# EasyEDA Pro project LOONGSON_DOCKER.epro, board PCB1
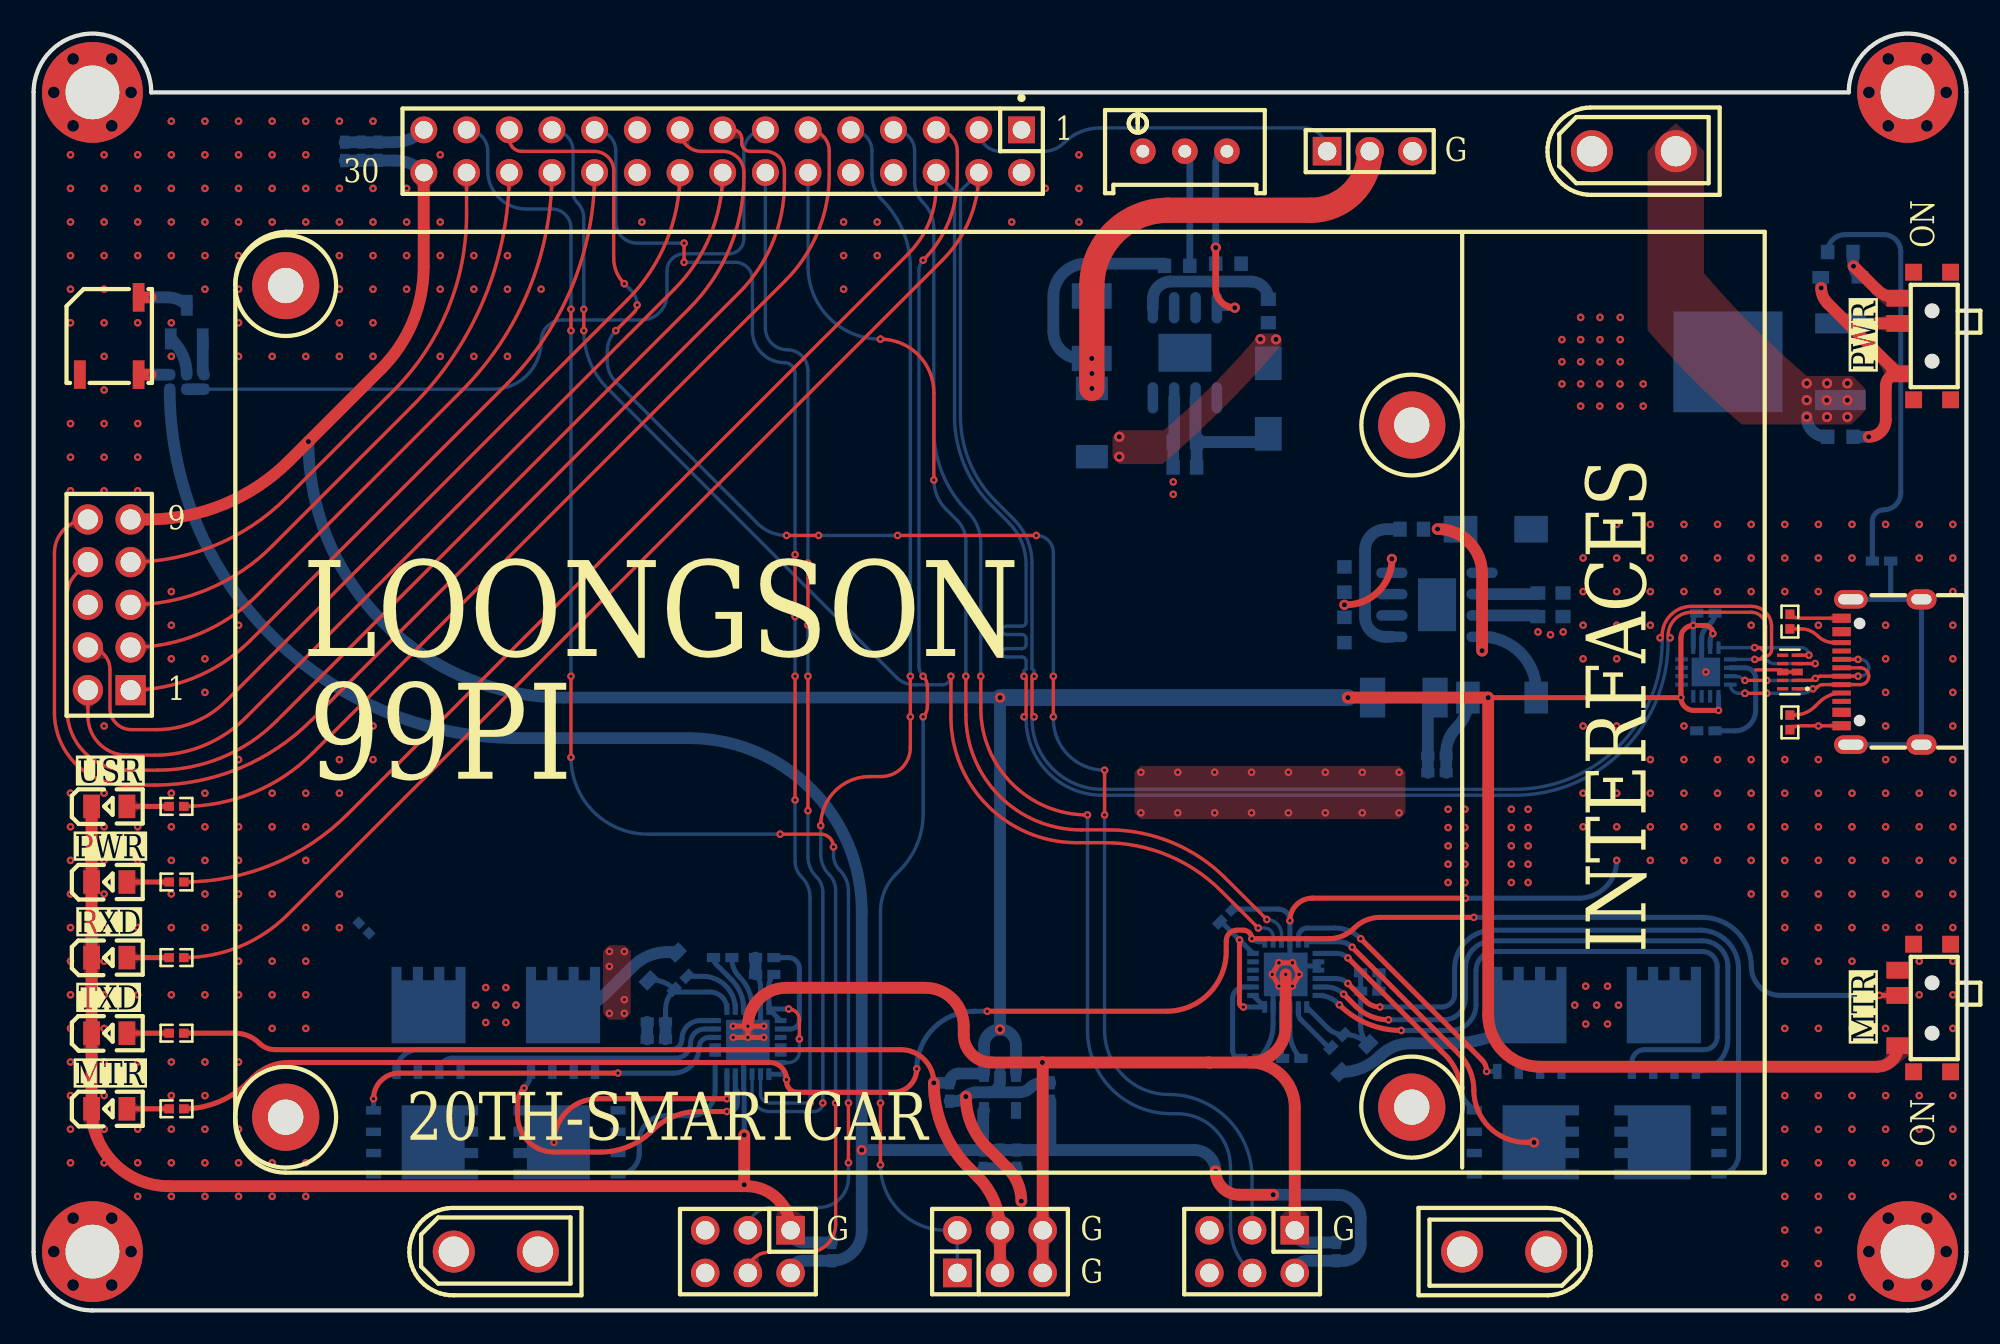
[diagram p3: board, top side]
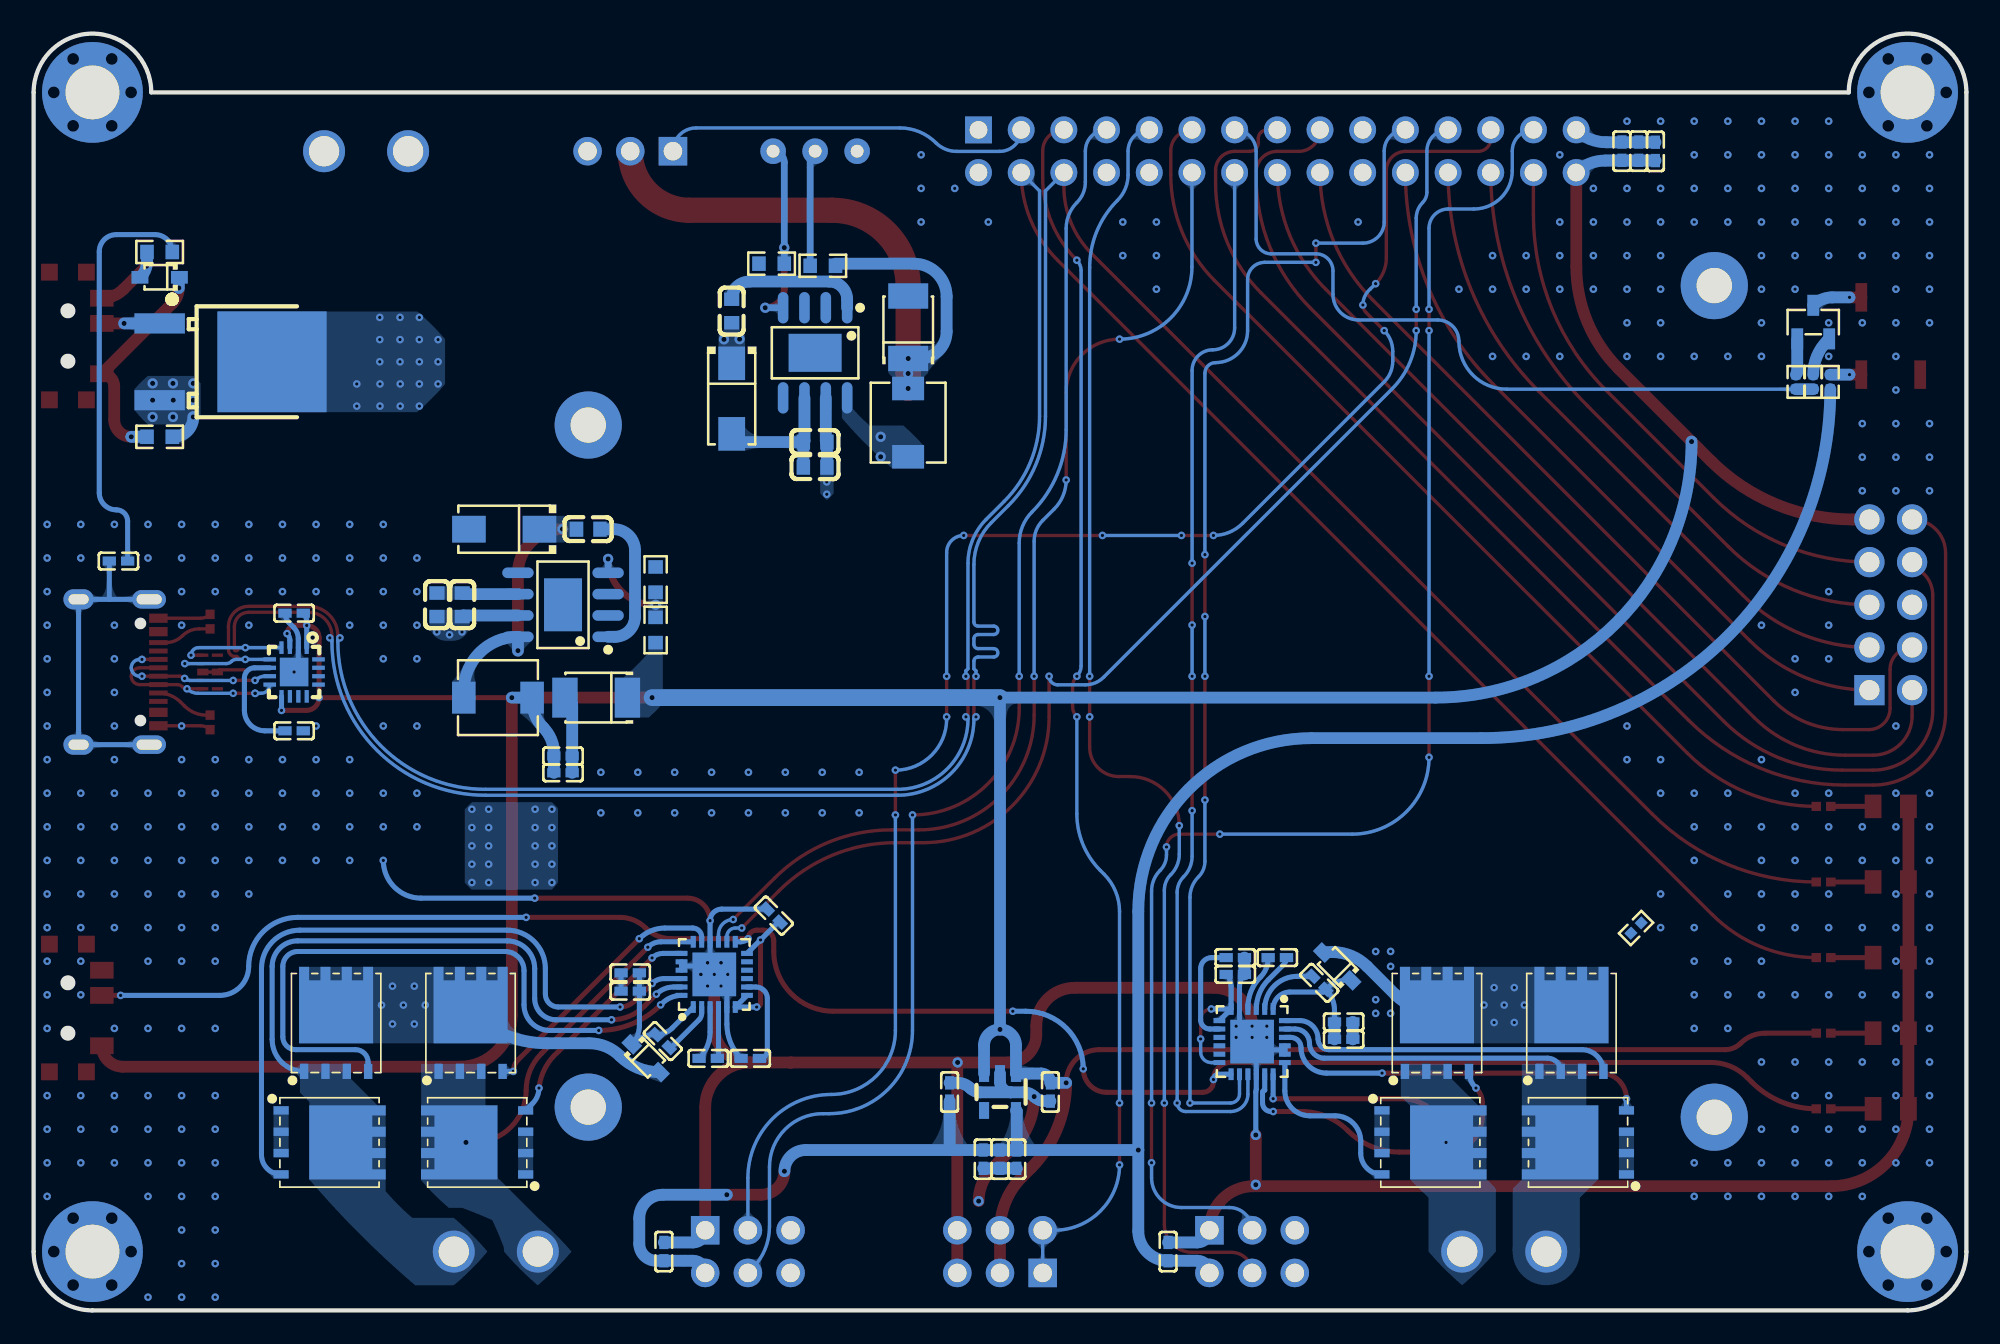
[diagram p4: board, bottom side, seen from below]

Outline 115 x 76 mm; copper layers: Top Layer, Bottom Layer. Coordinates in mm from the lower left corner of the outline.
Outline path: 0,72.5 arc(3.5,76) 7,72.5 108,72.5 arc(111.5,76) 115,72.5 115,3.5 arc(113.97,1.03) 111.5,0 3.5,0 arc(1.03,1.03) 0,3.5 0,72.5
Stack: Top Layer 0.035mm / Dielectric1 1.51mm FR4 er 4.5 / Bottom Layer 0.035mm

## Design rules (mm)
net D+: DP1
net D-: DP1
net 99PI_TXD_0: DP2
net 99PI_RXD_0: DP2
template: 自定义配置
spacing copperThickness1oz (default): track to track 0.102, other pairs 0.152 to 0.3
spacing copperThickness2oz: track to track 0.203, other pairs 0.152 to 0.3
track width copperThickness1oz (default): min 0.13, default 0.13, max 3
track width copperThickness2oz: min 0.203, default 0.254, max 2.54
differential pair differentialPair (default): width min 0.127, default 0.254, max 2.54; gap min 0.152, default 0.152
via viaSize (default): diameter min 0.45, default 0.61, max 10; hole min 0.2, default 0.305, max 6.3

## Placement (name value [footprint] x y rotation side)
BUZZER2  4kHz  [BUZ-SMD_L5.0-W5.5-P4.60]  4.5 58 90 top
C1  100nF  [C0402]  47.5 3.5 270 bottom
C2  100nF  [C0402]  58.5 9 90 bottom
C3  100nF  [C0402]  56.5 9 90 bottom
C4  100nF  [C0402]  57.5 9 90 bottom
C5  4.7uF  [C0402]  77.5 3.5 270 bottom
C56  10uF  [C0402]  54.5 13 90 bottom
C57  10uF  [C0402]  60.5 13 270 bottom
C65  100nF  [C0402]  109.95 44.6 0 bottom
C70  10uF  [C0603]  89.5 42 270 bottom
C78  100nF  [C0603]  82 46.5 180 bottom
C79  220uF  [CASE-B_3528]  81.53 36.47 0 bottom
C80  10uF  [C0603]  91 42 270 bottom
C81  10uF  [C0603]  68.5 50.19 180 bottom
C82  100nF  [C0603]  73.46 59.49 90 bottom
C83  220uF  [CASE-B_3528]  62.96 58.52 90 bottom
C84  10uF  [C0603]  68.5 51.69 180 bottom
C91  10uF  [C0402]  37.05 17.17 180 bottom
C92  100nF  [C0402]  37.05 16.13 180 bottom
C93  10uF  [C0402]  79.5 20.09 0 bottom
C94  100nF  [C0402]  79.5 19 0 bottom
C95  1uF  [C0402]  77.57 16.03 225 bottom
C96  1uF  [C0402]  38.5 19.5 45 bottom
C97  100nF  [C0402]  41 21 180 bottom
C98  100nF  [C0402]  74.86 15 0 bottom
C99  1uF  [C0402]  70.96 23.5 225 bottom
C100  1uF  [C0402]  72.36 15 180 bottom
C101  1uF  [C0402]  43.5 21 0 bottom
C102  1uF  [C0402]  43.5 20 0 bottom
C103  100nF  [C0402]  18.5 68.99 270 bottom
C104  100nF  [C0402]  19.5 69 270 bottom
C105  100nF  [C0402]  20.5 69 270 bottom
C106  100nF  [C0402]  83.5 33 0 bottom
C107  4.7uF  [C0402]  83.5 32 0 bottom
C108  100nF  [C0402]  99.5 41.5 180 bottom
C109  100nF  [C0402]  99.5 34.5 180 bottom
CN5  XT30UPB-M  [CONN-TH_XT30UPB-M]  95.22 69 0 top
CN6  XT30UPB-M  [CONN-TH_XT30UPB-M]  27.5 3.5 0 top
CN7  XT30UPB-M  [CONN-TH_XT30UPB-M]  87.5 3.5 180 top
D1  SS34  [SMA_L4.3-W2.5-LS5.0-RD]  87 46.5 0 bottom
D3  SS34  [SMA_L4.3-W2.5-LS5.0-RD]  73.46 54.28 270 bottom
D4  1N5819WS  [SOD-323_L1.8-W1.3-LS2.5-RD]  78.58 15.01 225 bottom
D5  1N5819WS  [SOD-323_L1.8-W1.3-LS2.5-RD]  37.43 20.47 45 bottom
D6  1N5819WS  [SOD-323_L1.8-W1.3-LS2.5-RD]  107.5 61.5 0 bottom
H1  PZ254V-11-03P  [HDR-TH_3P-P2.54-V-M]  79.5 69 0 top
H4  PZ254V-12-6P  [HDR-TH_6P-P2.54-V-M-R2-C3-S2.54]  42.5 3.5 180 top
H5  PZ254V-12-6P  [HDR-TH_6P-P2.54-V-M-R2-C3-S2.54]  72.5 3.5 180 top
H6  X6521WV-2x15H-C60D30  [HDR-TH_30P-P2.54-V-M-R2-C15-S2.54-BL]  41 69 180 top
H9  PZ2.54-2*5  [HDR-TH_10P-P2.54-V-M-R2-C5-S2.54-1]  4.5 42 90 top
H10  PZ254V-12-6P  [HDR-TH_6P-P2.54-V-M-R2-C3-S2.54]  57.5 3.5 0 top
L5  15uH  [IND-SMD_L4.6-W4.2_SMMS0420]  87.37 36.47 0 bottom
L6  15uH  [IND-SMD_L4.6-W4.2_SMMS0420]  62.97 52.84 270 bottom
LED5  NCD0805R1  [LED0805-R-RD]  4.5 21 0 top
LED6  NCD0805R1  [LED0805-R-RD]  4.5 25.5 0 top
LED7  NCD0805R1  [LED0805-R-RD]  4.5 16.5 0 top
LED8  NCD0805R1  [LED0805-R-RD]  4.5 30 0 top
LED9  NCD0805R1  [LED0805-R-RD]  4.5 12 0 top
NOREF  -  [Pad_e26]  111.5 72.5 0 top
NOREF#2  -  [Pad_e137]  82 12.1 0 top
NOREF#3  -  [Pad_e44]  3.5 72.5 0 top
NOREF#4  -  [Pad_e138]  82 52.7 0 top
NOREF#5  -  [Pad_e133]  15 61 0 top
NOREF#6  -  [Pad_e48]  3.5 3.5 0 top
NOREF#7  -  [Pad_e43]  111.5 3.5 0 top
NOREF#8  -  [Pad_e136]  15 11.5 0 top
Q1  SS8050  [SOT-23-3_L2.9-W1.3-P1.90-LS2.4-BR]  9.11 58.83 270 bottom
Q2  AOD403  [TO-252-3_L6.6-W6.1-P4.58-LS10.1-BR-2]  104.16 56.47 0 bottom
R77  5.1kΩ  [R0402]  104.5 35 270 top
R78  5.1kΩ  [R0402]  104.5 41 90 top
R84  4.7kΩ  [R0603]  107.5 52 0 bottom
R85  1kΩ  [R0603]  107.5 63 0 bottom
R88  3.3kΩ  [R0603]  71.09 62.31 180 bottom
R89  15kΩ  [R0603]  68.04 62.18 180 bottom
R96  10Ω  [R0402]  8.1 55.27 90 bottom
R97  4.7kΩ  [R0402]  10.14 55.27 90 bottom
R98  10kΩ  [R0402]  9.11 55.27 90 bottom
R99  10kΩ  [RES-ADJ-TH_3P-L10.0-W10.0-P2.50-L]  68.5 69 0 top
R100  330Ω  [R0402]  8.5 12 180 top
R101  330Ω  [R0402]  8.5 21 180 top
R102  330Ω  [R0402]  8.5 25.5 180 top
R103  330Ω  [R0402]  8.5 30 180 top
R104  330Ω  [R0402]  8.5 16.5 180 top
R105  3.3kΩ  [R0603]  77.99 43.5 270 bottom
R106  10kΩ  [R0603]  77.99 40.5 270 bottom
R112  0Ω  [R0402]  19.65 22.76 135 bottom
SW1  SK-3296S-01-L1  [SW-SMD_3P-P1.50_L2.7-W6.6]  112.5 58 90 top
SW7  SK-3296S-01-L1  [SW-SMD_3P-P1.50_L2.7-W6.6]  112.5 18 90 top
U8  TPS5430DDA  [ESOP-8_L4.9-W3.9-P1.27-LS6.0-BL-EP-2]  83.5 42 90 bottom
U9  DRV8701ERGET  [VQFN-24_L4.0-W4.0-P0.50-BL-EP2.5]  74.5 20 180 bottom
U10  TPH1R403NL  [TDSON-8_L5.9-W5.2-P1.27-BL]  89 16 180 bottom
U11  TPH1R403NL  [TDSON-8_L5.9-W5.2-P1.27-BL]  87.5 10 90 bottom
U12  TPH1R403NL  [TDSON-8_L5.9-W5.2-P1.27-BL]  97 16 180 bottom
U13  TPH1R403NL  [TDSON-8_L5.9-W5.2-P1.27-BL]  98.5 10 270 bottom
U14  HT7833  [SOT-23-5_L2.9-W1.6-P0.95-LS2.8-BL]  57.5 13 0 bottom
U20  CH343P  [TQFN-16_L3.0-W3.0-P0.50-BL-EP1.7]  99.5 38 0 bottom
U32  TPS5430DDA  [ESOP-8_L4.9-W3.9-P1.27-LS6.0-BL-EP-2]  68.5 57 0 bottom
U33  TPH1R403NL  [TDSON-8_L5.9-W5.2-P1.27-BL]  31.5 16 180 bottom
U34  TPH1R403NL  [TDSON-8_L5.9-W5.2-P1.27-BL]  33 10 270 bottom
U35  TPH1R403NL  [TDSON-8_L5.9-W5.2-P1.27-BL]  23.5 16 180 bottom
U36  TPH1R403NL  [TDSON-8_L5.9-W5.2-P1.27-BL]  22 10 90 bottom
U37  DRV8701ERGET  [VQFN-24_L4.0-W4.0-P0.50-BL-EP2.5]  42.5 16 0 bottom
U38  RCLAMP0524P-ES  [DFN2510-10_L2.5-W1.0-P0.50-BL]  104.5 38 90 top
USB1  TYPE-C 16PIN 2MD(073)  [USB-C-SMD_TYPE-C-6PIN-2MD-073]  109.95 38 90 top

## Footprints (pads in the part's own frame, mm; a bottom-side part is the same pattern mirrored in y, then rotated)
BUZ-SMD_L5.0-W5.5-P4.60
  rect 1.7x0.7 smd: 1(-2.3,-1.75) 2(2.3,-1.75) 3(-2.3,1.75)
C0402
  rect 0.79x0.54 smd: 1(-0.545,0) 2(0.545,0)
C0603
  rect 0.8x0.9 smd: 1(-0.7,0) 2(0.7,0)
CASE-B_3528
  rect 1.506x2.376 smd: 1(-1.861,0) 2(1.861,0)
CONN-TH_XT30UPB-M
  round 2.5 hole 1.8: 1(-2.5,0) 2(2.5,0)
DFN2510-10_L2.5-W1.0-P0.50-BL
  rect 0.2x0.665 smd: 1(-1,-0.433) 2(-0.5,-0.433) 4(0.5,-0.433) 5(1,-0.433) 6(1,0.433) 7(0.5,0.433) 9(-0.5,0.433) 10(-1,0.433)
  rect 0.4x0.665 smd: 3(0,-0.433) 8(0,0.433)
ESOP-8_L4.9-W3.9-P1.27-LS6.0-BL-EP-2
  oval 0.63x1.865 smd: 1(-1.905,-2.683) 2(-0.635,-2.683) 3(0.635,-2.683) 4(1.905,-2.683) 5(1.905,2.683) 6(0.635,2.683) 7(-0.635,2.683) 8(-1.905,2.683)
  rect 3.15x2.26 smd: 9(0,0)
HDR-TH_3P-P2.54-V-M
  rect 1.7x1.7 hole 1.1: 1(-2.54,0)
  round 1.7 hole 1.1: 2(0,0) 3(2.54,0)
HDR-TH_6P-P2.54-V-M-R2-C3-S2.54
  rect 1.7x1.7 hole 1.1: 1(-2.54,-1.27)
  round 1.7 hole 1.1: 2(-2.54,1.27) 3(0,-1.27) 4(0,1.27) 5(2.54,-1.27) 6(2.54,1.27)
HDR-TH_10P-P2.54-V-M-R2-C5-S2.54-1
  rect 1.8x1.8 hole 1.2: 1(-5.08,-1.27)
  round 1.8 hole 1.2: 2(-5.08,1.27) 3(-2.54,-1.27) 4(-2.54,1.27) 5(0,-1.27) 6(0,1.27) 7(2.54,-1.27) 8(2.54,1.27) 9(5.08,-1.27) 10(5.08,1.27)
HDR-TH_30P-P2.54-V-M-R2-C15-S2.54-BL
  rect 1.6x1.6 hole 1.05: 1(-17.78,-1.27)
  round 1.6 hole 1.05: 2(-17.78,1.27) 3(-15.24,-1.27) 4(-15.24,1.27) 5(-12.7,-1.27) 6(-12.7,1.27) 7(-10.16,-1.27) 8(-10.16,1.27) 9(-7.62,-1.27) 10(-7.62,1.27) 11(-5.08,-1.27) 12(-5.08,1.27) 13(-2.54,-1.27) 14(-2.54,1.27) 15(0,-1.27) 16(0,1.27) 17(2.54,-1.27) 18(2.54,1.27) 19(5.08,-1.27) 20(5.08,1.27) 21(7.62,-1.27) 22(7.62,1.27) 23(10.16,-1.27) 24(10.16,1.27) 25(12.7,-1.27) 26(12.7,1.27) 27(15.24,-1.27) 28(15.24,1.27) 29(17.78,-1.27) 30(17.78,1.27)
IND-SMD_L4.6-W4.2_SMMS0420
  rect 1.4x1.9 smd: 1(2.032,0) 2(-2.032,0)
LED0805-R-RD
  rect 1x1.399 smd: 1(1.05,0) 2(-1.05,0)
Pad_e26
  round 6 hole 3.2: 31(0,0)
Pad_e43
  round 6 hole 3.2: 31(0,0)
Pad_e44
  round 6 hole 3.2: 31(0,0)
Pad_e48
  round 6 hole 3.2: 31(0,0)
Pad_e133
  round 4 hole 2.1: 32(0,0)
Pad_e136
  round 4 hole 2.1: 32(0,0)
Pad_e137
  round 4 hole 2.1: 32(0,0)
Pad_e138
  round 4 hole 2.1: 32(0,0)
R0402
  rect 0.566x0.54 smd: 1(-0.433,0) 2(0.433,0)
R0603
  rect 0.806x0.864 smd: 1(-0.753,0) 2(0.753,0)
RES-ADJ-TH_3P-L10.0-W10.0-P2.50-L
  round 1.524 hole 0.762: 1(-2.5,0) 2(0,0) 3(2.5,0)
SMA_L4.3-W2.5-LS5.0-RD
  rect 2x1.593 smd: 1(-2.1,0) 2(2.1,0)
SOD-323_L1.8-W1.3-LS2.5-RD
  rect 1x0.75 smd: 1(-1.173,0) 2(1.173,0)
SOT-23-3_L2.9-W1.3-P1.90-LS2.4-BR
  rect 1.25x0.7 smd: 1(1,-0.95) 2(1,0.95) 3(-1,0)
SOT-23-5_L2.9-W1.6-P0.95-LS2.8-BL
  rect 0.6x1 smd: 1(-0.95,-1.1) 2(0,-1.1) 3(0.95,-1.1) 4(0.95,1.1) 5(-0.95,1.1)
SW-SMD_3P-P1.50_L2.7-W6.6
  rect 1x1 smd: 0(-3.8,0.641) 0(-3.8,-1.559) 0(3.8,0.641) 0(3.8,-1.559)
  rect 1x1.4 smd: 1(-2.25,1.559) 2(0.75,1.559) 3(2.25,1.559)
TDSON-8_L5.9-W5.2-P1.27-BL
  rect 0.5x0.9 smd: 1(-1.905,-1.775) 2(-0.635,-1.775) 3(0.635,-1.775) 4(1.905,-1.775)
  custom 4.41x4.55 smd: 5(0,1.775)
TO-252-3_L6.6-W6.1-P4.58-LS10.1-BR-2
  rect 3x1.2 smd: 1(3.342,-2.285) 3(3.342,2.285)
  rect 6.5x6 smd: 2(-3.342,0)
TQFN-16_L3.0-W3.0-P0.50-BL-EP1.7
  rect 0.25x0.75 smd: 1(-0.749,-1.45) 2(-0.248,-1.45) 3(0.252,-1.45) 4(0.751,-1.45) 9(0.75,1.45) 10(0.25,1.45) 11(-0.25,1.45) 12(-0.749,1.45)
  rect 0.75x0.25 smd: 5(1.45,-0.75) 6(1.45,-0.25) 7(1.45,0.25) 8(1.45,0.75) 13(-1.45,0.75) 14(-1.45,0.25) 15(-1.45,-0.25) 16(-1.45,-0.75)
  rect 1.7x1.7 smd: 17(0.001,0)
USB-C-SMD_TYPE-C-6PIN-2MD-073
  rect 0.55x1.1 smd: 1(-3.2,2.375) 2(-2.4,2.375) 11(2.4,2.375) 12(3.2,2.375)
  rect 0.3x1.1 smd: 3(-1.75,2.375) 4(-1.25,2.375) 5(-0.75,2.375) 6(-0.25,2.375) 7(0.25,2.375) 8(0.75,2.375) 9(1.25,2.375) 10(1.75,2.375)
  oval 1.1x2 hole 0.6x1.5: 13(-4.325,1.825) 14(4.325,1.825)
  oval 1.2x1.8 hole 0.6x1.2: 13(-4.325,-2.375) 14(4.325,-2.375)
VQFN-24_L4.0-W4.0-P0.50-BL-EP2.5
  rect 0.3x0.7 smd: 1(-1.25,-1.942) 2(-0.75,-1.942) 3(-0.25,-1.942) 4(0.25,-1.942) 5(0.75,-1.942) 6(1.25,-1.942) 13(1.25,1.942) 14(0.75,1.942) 15(0.25,1.942) 16(-0.25,1.942) 17(-0.75,1.942) 18(-1.25,1.942)
  rect 0.7x0.3 smd: 7(1.948,-1.25) 8(1.948,-0.75) 9(1.948,-0.25) 10(1.948,0.25) 11(1.948,0.75) 12(1.948,1.25) 19(-1.948,1.25) 20(-1.948,0.75) 21(-1.948,0.25) 22(-1.948,-0.25) 23(-1.948,-0.75) 24(-1.948,-1.25)
  rect 2.6x2.6 smd: 25(0.001,-0.001)

## Nets
As in the schematic, except:
PGND: C2.1 C3.1 C4.1 C56.1 C57.1 C70.1 C79.2 C80.1 C81.1 C83.2 C84.1 C91.2 C92.2 C93.2 C94.2 C106.1 C107.1 CN5.1 D1.2 D3.2 H1.3 R88.1 R105.1 R112.1 U8.6 U8.9 U11.1 U11.2 U11.3 U13.1 U13.2 U13.3 U14.2 U32.6 U32.9 U34.1 U34.2 U34.3 U36.1 U36.2 U36.3
$2N2229: R88.2 R99.3 U32.4

Pads without a net: BUZZER2 3; H4 5 6; H5 5 6; H6 2 8 10; NOREF 31; NOREF#2 32; NOREF#3 31; NOREF#4 32; NOREF#5 32; NOREF#6 31; NOREF#7 31; NOREF#8 32; R99 1; SW1 0; SW7 0 3; U8 2 3 5; U9 9 10 11; U14 4; U20 10 11 12 13 14 15 16; U32 2 3 5; U37 9 10 11; U38 6 7 9 10; USB1 2 3 9 11

## Via types
v1: diameter 1.3, hole 0.7, Top Layer to Bottom Layer, 24 vias
v2: diameter 0.45, hole 0.2, Top Layer to Bottom Layer, 544 vias
v3: diameter 0.61, hole 0.305, Top Layer to Bottom Layer, 41 vias

## Routing (per net, layer and track width the routed paths; a pad name or vN(x,y) marks a point on that pad's centre or on a via; arc(x,y) is an arc through that point)
+3V3: length 127.4
  Top Layer w0.7: v3(73.76,6.88) 71.72,6.88 arc(70.74,7.29) v3(70.33,8.28)
  Bottom Layer w0.7: v3(49.27,9.54) 49.27,4.73 arc(48.75,3.47) C1.2 45.76,2.96 arc(45.25,2.74) H4.2 ; v3(49.27,9.54) 49.27,23.75 arc(46.25,31.04) 38.96,34.06 28.87,34.06 arc(14.18,40.15) R96.1 ; v3(49.27,9.54) C3.2 ; 60.46,9.54 69.06,9.54 arc(69.96,9.18) v3(70.33,8.28) ; 60.46,9.54 C2.2 C4.2 C3.2 ; 60.46,9.54 arc(60.49,9.56) 60.5,9.59 C57.2 ; v3(73.76,6.88) 77.57,6.88 arc(78.55,6.48) 78.96,5.49 78.96,3.97 arc(78.67,3.25) 77.95,2.96 C5.2 75.76,2.96 arc(75.25,2.74) H5.2 ; C3.2 56.5,11.85 arc(56.51,11.89) U14.5
+5V: length 278
  Top Layer w0.3: v3(86.55,36.47) 98.01,36.47 arc(98.01,36.47) v2(98.01,36.48) ; R104.1 11.99,16.5 arc(12.77,16.34) 13.43,15.9 arc(13.85,15.62) 14.35,15.52 51.59,15.52 arc(52.98,14.94) v3(53.56,13.54) ; v2(98.01,36.48) 98.01,40.03 arc(98.23,40.55) v2(98.75,40.77) 99.43,40.77 arc(99.78,40.63) v2(99.92,40.29) ; v2(98.01,36.48) arc(98.24,35.94) 98.78,35.71 v2(100.25,35.71)
  Top Layer w0.7: H10.3 H10.4 arc(57.16,6.49) 56.18,7.95 55.67,8.46 arc(54.11,10.79) v3(53.56,13.54) ; H9.9 6.78,47.08 arc(11.34,47.99) 15.21,50.57 v3(16.35,51.72) 20.7,56.06 arc(22.56,58.84) 23.21,62.13 23.21,67.71 arc(23.21,67.72) H6.30 ; v3(78.2,36.48) arc(78.2,36.47) 78.2,36.47 v3(86.55,36.47) 86.55,17.59 arc(87.45,15.41) 89.63,14.5 109.7,14.5 arc(110.58,14.87) SW7.1
  Bottom Layer w0.3: U20.1 v2(98.75,40.77) 98.75,41.01 arc(98.8,41.27) C108.2 ; U20.3 99.75,39.88 arc(99.79,40.1) v2(99.92,40.29) ; U20.9 v2(100.25,35.71)
  Bottom Layer w0.7: U14.3 58.45,15.77 arc(58.17,16.45) v3(57.5,16.72) ; v3(53.56,13.54) C56.2 arc(54.66,13.94) 55.06,14.1 U14.1 56.55,15.77 arc(56.83,16.45) v3(57.5,16.72) ; v3(86.55,36.47) L5.2 85.34,36.3 arc(85.17,35.43) 84.68,34.7 arc(84.21,34) 84.04,33.17 C106.2 C107.2 ; v3(57.5,16.72) 57.5,36.47 arc(57.5,36.47) v3(57.5,36.48) 31.59,36.48 arc(20.82,40.94) v3(16.35,51.72) ; C103.2 21.5,68.44 arc(22.43,68.26) H6.30
  Bottom Layer w1: v3(78.2,36.48) v3(57.5,36.48)
DGND: length 240.2
  Top Layer w0.2: USB1.1 105.06,34.8 arc(104.76,34.74) R77.2 ; 102.46,38.13 103.94,38.13 arc(104.03,38.09) U38.8 U38.3 ; USB1.12 105.06,41.2 arc(104.76,41.26) R78.2
  Top Layer w0.3: v2(42.5,16.92) v2(42.5,16.25) ; v2(42.5,16.92) v2(41.62,16.92) ; v2(42.5,16.92) v2(43.45,16.92) ; v2(42.5,16.25) v2(43.45,16.25) ; v2(42.5,16.25) v2(41.63,16.25) ; v2(74.9,19.31) v2(75.3,20) v2(74.9,20.69) v2(74.1,20.69) v2(73.7,20) v2(74.1,19.31) ; v2(85.19,24.54) 76.09,24.54 arc(75.14,24.15) v2(74.75,23.2)
  Top Layer w0.7: LED8.2 LED6.2 LED5.2 LED7.2 LED9.2 arc(4.8,8.74) 8.06,7.39 42.19,7.39 ; v2(74.5,20) 74.5,16.89 arc(73.88,15.38) 72.37,14.76 ; 42.19,7.39 42.42,7.39 arc(44.27,6.62) H4.1 ; 42.19,7.39 arc(42.26,7.42) v3(42.28,7.48) v3(42.28,10.44) ; 72.37,14.76 69.93,14.76 ; 72.37,14.76 arc(74.26,13.98) 75.04,12.09 H5.1 ; 69.93,14.76 v3(60.02,14.76) ; 69.93,14.76 arc(69.95,14.75) 69.96,14.73 ; v3(60.02,14.76) 56.99,14.76 arc(55.82,15.24) 55.34,16.41 55.34,16.92 arc(54.67,18.53) 53.06,19.2 44.79,19.2 arc(43.17,18.53) v2(42.5,16.92) ; v3(60.02,14.76) arc(60.04,14.75) 60.04,14.74 H10.6 H10.5
  Bottom Layer w0.3: 40.55,15.51 U37.21 ; 40.55,15.51 42.01,15.51 arc(42.13,15.52) 42.25,15.57 ; 40.55,15.51 U37.20 ; v3(42.28,10.44) 42.28,12.98 arc(42.27,13.07) 42.25,13.16 U37.16 42.25,15.57 ; v2(85.19,24.54) 91.95,24.54 arc(93.54,25.2) v2(94.19,26.79) ; 74.75,20.43 74.75,20.25 arc(74.68,20.07) v2(74.5,20) arc(73.97,19.78) 73.75,19.25 U9.5 73.75,17.04 arc(73.53,15.94) C100.1 ; 74.75,20.43 U9.16 v2(74.75,23.2) arc(74.55,23.68) 74.06,23.89 C99.1 ; 74.75,20.43 arc(74.87,20.48) 75,20.5 76.45,20.5 ; 76.45,20.5 U9.21 ; 76.45,20.5 U9.20 ; 42.25,15.57 arc(42.43,15.75) U37.25 arc(43.03,16.22) 43.25,16.75 U37.5 43.25,19.29 arc(43.17,19.67) C102.1 ; C65.1 109.41,46.98 arc(109.6,47.46) 110.08,47.65 arc(110.8,47.95) 111.09,48.67 111.09,63.02 arc(110.8,63.74) 110.08,64.03 107.78,64.03 arc(107.05,63.73) R85.1 ; v2(99.5,38) arc(99.32,38.07) 99.25,38.25 U20.2 99.25,39.98 arc(99.33,40.35) 99.54,40.67 99.82,40.95 arc(99.99,41.2) C108.1
  Bottom Layer w0.7: C103.1 21.44,69.53 arc(22.4,69.72) H6.29 ; C101.1 C102.1 ; C1.1 45.76,4.04 arc(45.25,4.26) H4.1 ; Q1.2 8.28,57.71 arc(8.9,56.79) R98.2 ; C5.1 75.76,4.04 arc(75.25,4.26) H5.1
  vias: v2(2.19,68.79) v2(2.19,66.79) v2(2.19,64.79) v2(2.19,62.79) v2(2.19,60.79) v2(2.19,58.79) v2(2.19,52.79) v2(2.19,50.79) v2(2.19,48.79) v2(2.19,30.79) v2(2.19,28.79) v2(2.19,26.79) v2(2.19,24.79) v2(2.19,22.79) v2(2.19,20.79) v2(2.19,18.79) v2(2.19,16.79) v2(2.19,14.79) v2(2.19,12.79) v2(2.19,10.79) v2(2.19,8.79) v2(4.19,68.79) v2(4.19,66.79) v2(4.19,64.79) v2(4.19,62.79) v2(4.19,60.79) v2(4.19,58.79) v2(4.19,56.79) v2(4.19,54.79) v2(4.19,52.79) v2(4.19,50.79) v2(4.19,48.79) v2(4.19,34.79) v2(4.19,30.79) v2(4.19,28.79) v2(4.19,26.79) v2(4.19,24.79) v2(4.19,22.79) v2(4.19,20.79) v2(4.19,18.79) v2(4.19,16.79) v2(4.19,14.79) v2(4.19,12.79) v2(4.19,10.79) v2(4.19,8.79) v2(6.19,68.79) v2(6.19,66.79) v2(6.19,64.79) v2(6.19,62.79) v2(6.19,58.79) v2(6.19,52.79) v2(6.19,50.79) v2(6.19,48.79) v2(6.19,28.79) v2(6.19,26.79) v2(6.19,22.79) v2(6.19,18.79) v2(6.19,14.79) v2(6.19,10.79) v2(6.19,8.79) v2(6.19,6.79) v2(8.19,70.79) v2(8.19,68.79) v2(8.19,66.79) v2(8.19,64.79) v2(8.19,62.79) v2(8.19,58.79) v2(8.19,56.79) v2(8.19,42.79) v2(8.19,40.79) v2(8.19,38.79) v2(8.19,30.79) v2(8.19,28.79) v2(8.19,26.79) v2(8.19,24.79) v2(8.19,22.79) v2(8.19,18.79) v2(8.19,14.79) v2(8.19,12.79) v2(8.19,10.79) v2(8.19,8.79) v2(8.19,6.79) v2(10.19,70.79) v2(10.19,68.79) v2(10.19,66.79) v2(10.19,64.79) v2(10.19,62.79) v2(10.19,60.79) v2(10.19,38.79) v2(10.19,36.79) v2(10.19,30.79) v2(10.19,28.79) v2(10.19,26.79) v2(10.19,24.79) v2(10.19,22.79) v2(10.19,18.79) v2(10.19,14.79) v2(10.19,12.79) v2(10.19,10.79) v2(10.19,8.79) v2(10.19,6.79) v2(12.19,70.79) v2(12.19,68.79) v2(12.19,66.79) v2(12.19,64.79) v2(12.19,62.79) v2(12.19,60.79) v2(12.19,58.79) v2(12.19,56.79) v2(12.19,40.79) v2(12.19,32.79) v2(12.19,28.79) v2(12.19,26.79) v2(12.19,24.79) v2(12.19,22.79) v2(12.19,20.79) v2(12.19,18.79) v2(12.19,14.79) v2(12.19,10.79) v2(12.19,8.79) v2(12.19,6.79) v2(14.19,70.79) v2(14.19,68.79) v2(14.19,66.79) v2(14.19,64.79) v2(14.19,56.79) v2(14.19,30.79) v2(14.19,28.79) v2(14.19,24.79) v2(14.19,20.79) v2(14.19,18.79) v2(14.19,16.79) v2(14.19,8.79) v2(14.19,6.79) v2(16.19,70.79) v2(16.19,68.79) v2(16.19,66.79) v2(16.19,64.79) v2(16.19,56.79) v2(16.19,30.79) v2(16.19,28.79) v2(16.19,26.79) v2(16.19,22.79) v2(16.19,20.79) v2(16.19,18.79) v2(16.19,16.79) v2(16.19,8.79) v2(16.19,6.79) v2(18.19,70.79) v2(18.19,66.79) v2(18.19,64.79) v2(18.19,62.79) v2(18.19,60.79) v2(18.19,58.79) v2(18.19,56.79) v2(18.19,32.79) v2(18.19,30.79) v2(18.19,24.79) v2(18.19,22.79) v2(20.19,70.79) v2(20.19,66.79) v2(20.19,64.79) v2(20.19,62.79) v2(20.19,60.79) v2(20.19,58.79) v2(20.19,56.79) v2(20.19,34.79) v2(20.19,32.79) v2(22.19,66.79) v2(22.19,64.79) v2(22.19,62.79) v2(22.19,60.79) v2(24.19,68.79) v2(24.19,64.79) v2(24.19,62.79) v2(24.19,60.79) v2(24.19,56.79) v2(26.19,62.79) v2(26.19,60.79) v2(26.19,56.79) v2(28.19,62.79) v2(28.19,60.79) v2(28.19,56.79) v2(30.19,60.79) v2(36.19,64.79) v2(48.19,64.79) v2(48.19,62.79) v2(48.19,60.79) v2(50.19,64.79) v2(50.19,62.79) v2(58.19,64.79) v2(60.19,66.79) v2(62.19,68.79) v2(62.19,66.79) v2(62.19,64.79) v2(92.19,44.79) v2(92.19,42.79) v2(92.19,40.79) v2(92.19,38.79) v2(92.19,34.79) v2(92.19,30.79) v2(92.19,28.79) v2(94.19,46.79) v2(94.19,44.79) v2(94.19,42.79) v2(94.19,40.79) v2(94.19,38.79) v2(94.19,34.79) v2(94.19,30.79) v2(94.19,28.79) v2(96.19,46.79) v2(96.19,44.79) v2(96.19,42.79) v2(96.19,40.79) v2(96.19,32.79) v2(96.19,30.79) v2(96.19,28.79) v2(96.19,26.79) v2(98.19,46.79) v2(98.19,44.79) v2(98.19,42.79) v2(98.19,34.79) v2(98.19,32.79) v2(98.19,30.79) v2(98.19,28.79) v2(98.19,26.79) v2(100.19,46.79) v2(100.19,44.79) v2(100.19,42.79) v2(100.19,32.79) v2(100.19,30.79) v2(100.19,28.79) v2(100.19,26.79) v2(102.19,46.79) v2(102.19,44.79) v2(102.19,42.79) v2(102.19,40.79) v2(102.19,32.79) v2(102.19,30.79) v2(102.19,28.79) v2(102.19,26.79) v2(102.19,24.79) v2(104.19,46.79) v2(104.19,44.79) v2(104.19,42.79) v2(104.19,32.79) v2(104.19,30.79) v2(104.19,28.79) v2(104.19,26.79) v2(104.19,24.79) v2(104.19,22.79) v2(104.19,20.79) v2(104.19,16.79) v2(104.19,12.79) v2(104.19,10.79) v2(104.19,8.79) v2(104.19,6.79) v2(104.19,4.79) v2(104.19,2.79) v2(104.19,0.79) v2(106.19,46.79) v2(106.19,44.79) v2(106.19,42.79) v2(106.19,40.79) v2(106.19,34.79) v2(106.19,32.79) v2(106.19,30.79) v2(106.19,28.79) v2(106.19,26.79) v2(106.19,24.79) v2(106.19,22.79) v2(106.19,20.79) v2(106.19,16.79) v2(106.19,12.79) v2(106.19,10.79) v2(106.19,8.79) v2(106.19,6.79) v2(106.19,4.79) v2(106.19,2.79) v2(106.19,0.79) v2(108.19,46.79) v2(108.19,44.79) v2(108.19,30.79) v2(108.19,28.79) v2(108.19,26.79) v2(108.19,24.79) v2(108.19,22.79) v2(108.19,20.79) v2(108.19,16.79) v2(108.19,12.79) v2(108.19,10.79) v2(108.19,8.79) v2(108.19,6.79) v2(108.19,0.79) v2(110.19,46.79) v2(110.19,40.79) v2(110.19,38.79) v2(110.19,36.79) v2(110.19,34.79) v2(110.19,32.79) v2(110.19,30.79) v2(110.19,28.79) v2(110.19,26.79) v2(110.19,24.79) v2(110.19,22.79) v2(110.19,16.79) v2(110.19,12.79) v2(110.19,10.79) v2(110.19,8.79) v2(112.19,46.79) v2(112.19,44.79) v2(112.19,30.79) v2(112.19,28.79) v2(112.19,26.79) v2(112.19,24.79) v2(112.19,22.79) v2(112.19,20.79) v2(112.19,18.79) v2(112.19,12.79) v2(112.19,10.79) v2(112.19,8.79) v2(114.19,46.79) v2(114.19,44.79) v2(114.19,42.79) v2(114.19,40.79) v2(114.19,38.79) v2(114.19,36.79) v2(114.19,34.79) v2(114.19,32.79) v2(114.19,30.79) v2(114.19,28.79) v2(114.19,26.79) v2(114.19,24.79) v2(114.19,22.79) v2(114.19,20.79) v2(114.19,18.79) v2(114.19,16.79) v2(114.19,12.79) v2(114.19,10.79) v2(114.19,8.79) v2(114.19,6.79)
PGND: length 36
  Top Layer w0.7: v3(55.47,12.73) arc(55.79,11.08) 56.72,9.69 57.96,8.46 arc(58.56,7.56) v3(58.77,6.5)
  Bottom Layer w0.3: C93.2 C94.2
  Bottom Layer w0.7: C84.1 C81.1 ; C84.1 72.97,51.69 arc(73.32,51.83) D3.2 ; C84.1 arc(69.15,51.71) 69.13,51.75 U32.6 ; U8.6 89.44,42.64 arc(89.48,42.65) C70.1 ; U14.2 57.5,13.62 arc(57.31,13.17) 56.87,12.98 ; 56.87,12.98 58.66,12.98 arc(59,13.05) 59.28,13.24 arc(59.62,13.46) 60.03,13.54 C57.1 ; 56.87,12.98 56.08,12.98 arc(55.75,12.91) v3(55.47,12.73) arc(55.17,12.53) 54.81,12.46 C56.1 ; C91.2 C92.2 ; C2.1 C4.1 C3.1 ; C107.1 C106.1 82.96,36.04 arc(83.08,36.35) C79.2
  vias: v2(34.26,21.37) v2(34.26,20.47) v2(34.26,17.68) v2(35.15,21.36) v2(35.15,18.5) v2(35.15,17.68) v2(65.88,32.03) v2(65.88,29.62) v2(68.08,32.03) v2(68.08,29.62) v2(70.27,32.03) v2(70.27,29.62) v2(72.47,32.03) v2(72.47,29.62) v2(74.66,32.03) v2(74.66,29.62) v2(76.86,32.03) v2(76.86,29.62) v2(79.05,32.03) v2(79.05,29.62) v2(81.25,32.03) v2(81.25,29.62)
(no net):
  vias: v1(1.2,72.5) v1(1.2,3.5) v1(2.35,74.49) v1(2.35,70.51) v1(2.35,5.49) v1(2.35,1.51) v1(4.65,74.49) v1(4.65,70.51) v1(4.65,5.49) v1(4.65,1.51) v1(5.8,72.5) v1(5.8,3.5) v1(109.2,72.5) v1(109.2,3.5) v1(110.35,74.49) v1(110.35,70.51) v1(110.35,5.49) v1(110.35,1.51) v1(112.65,74.49) v1(112.65,70.51) v1(112.65,5.49) v1(112.65,1.51) v1(113.8,72.5) v1(113.8,3.5)
99PI_RXD_0: length 164.6
  Top Layer w0.2: U38.5 v2(105.63,39) ; v2(58.93,35.33) 59.05,35.46 59.05,37.62 v2(58.93,37.74) ; v2(97.38,40.03) 97.25,40.16 arc(97.66,41.15) 98.65,41.56 102.2,41.56 arc(102.81,41.31) 103.06,40.7 103.06,39.33 arc(103.04,39.29) 103,39.28 102.91,39.28 102.73,39.45 v2(102.4,39.45) ; H6.6 53.7,66.9 arc(53.27,64.73) 52.04,62.89 18.69,29.54 arc(14.21,26.55) R102.1
  Bottom Layer w0.2: H6.6 54.79,66.64 54.79,53.23 arc(55.37,50.35) 57,47.91 58.03,46.88 arc(58.79,45.74) 59.05,44.4 59.05,40.98 arc(58.98,40.8) 58.8,40.73 57.88,40.73 arc(57.63,40.48) 57.88,40.23 58.8,40.23 arc(58.98,40.16) 59.05,39.98 59.05,39.64 arc(58.98,39.47) 58.8,39.39 57.88,39.39 arc(57.63,39.14) 57.88,38.89 58.8,38.89 arc(58.98,38.82) 59.05,38.64 59.05,38.19 58.93,38.07 v2(58.93,37.74) ; v2(58.93,35.33) 59.05,35.21 arc(60.38,31.99) 63.6,30.66 88.1,30.66 arc(94.57,33.34) 97.25,39.81 97.25,39.91 v2(97.38,40.03) ; U20.4 v2(102.4,39.45) 105.18,39.45 arc(105.5,39.32) v2(105.63,39)
99PI_TXD_0: length 164.7
  Top Layer w0.2: v2(59.53,37.74) 59.41,37.62 59.41,35.46 v2(59.53,35.33) ; v2(102.41,38.75) 102.73,38.75 102.91,38.92 103,38.92 arc(103.29,39.04) 103.41,39.33 103.41,40.7 arc(103.05,41.56) 102.2,41.91 98.65,41.91 arc(97.41,41.4) 96.9,40.16 v2(96.77,40.03) ; U38.4 v2(106.01,38.5) ; H6.4 arc(55.68,64.91) 54.08,62.52 15.12,23.56 arc(12.28,21.67) R101.1
  Bottom Layer w0.2: v2(106.01,38.5) 103.55,38.5 arc(103.37,38.54) 103.22,38.64 arc(103.09,38.72) 102.94,38.75 v2(102.41,38.75) U20.5 ; v2(59.53,35.33) 59.41,35.21 arc(60.63,32.24) 63.6,31.02 88.1,31.02 arc(94.32,33.59) 96.9,39.81 96.9,39.91 v2(96.77,40.03) ; v2(59.53,37.74) 59.53,38.07 59.41,38.19 59.41,44.47 arc(59.12,45.88) 58.33,47.08 57.25,48.16 arc(55.69,50.49) 55.15,53.23 55.15,66.64 H6.4
BUZZER: length 46.1
  Bottom Layer w0.2: R97.1 27.34,54.83 arc(29.36,55.67) 30.19,57.69 arc(30.57,58.58) 31.47,58.95 36.16,58.95 arc(37.24,59.4) 37.69,60.48 37.69,61.88 arc(37.99,62.59) 38.7,62.89 41.37,62.89 arc(42,63.15) 42.26,63.78 42.26,68.99 arc(42.63,69.9) H6.13
  Bottom Layer w0.7: R98.1 R97.1
D+: length 11.7
  Top Layer w0.2: v2(101.82,37.5) 103.12,37.5 v2(103.13,37.5) ; U38.2 105.73,37.5 arc(105.88,37.53) v2(106.01,37.62) arc(106.16,37.72) 106.33,37.75 USB1.6 v2(108.55,37.75) ; USB1.8 v2(108.55,38.75)
  Bottom Layer w0.2: U20.7 101.22,37.75 arc(101.55,37.69) v2(101.82,37.5) ; v2(108.55,38.75) 108.69,38.75 arc(109.04,38.6) 109.19,38.25 arc(109.04,37.9) 108.69,37.75 v2(108.55,37.75) ; v2(103.13,37.5) 105.72,37.5 arc(105.88,37.53) v2(106.01,37.62)
D-: length 11.8
  Top Layer w0.2: v2(103.13,36.73) 103.12,36.73 v2(101.82,36.73) ; USB1.7 108.69,38.25 arc(109.04,38.1) 109.19,37.75 arc(109.04,37.4) 108.69,37.25 USB1.5 106.48,37.25 arc(106.29,37.21) 106.14,37.11 arc(106.02,37.03) v2(105.87,37) U38.1
  Bottom Layer w0.2: v2(101.82,36.73) 101.47,36.73 arc(101.1,36.88) U20.8 ; v2(103.13,36.73) 105.23,36.73 arc(105.58,36.8) v2(105.87,37)
ENCODER_DIR_1: length 76.9
  Top Layer w0.2: v2(52.17,37.75) v2(52.17,35.33) 52.17,33.52 arc(51.66,32.29) 50.43,31.78 49.75,31.78 arc(47.69,30.92) v2(46.83,28.86) ; v2(47.72,12.35) 47.72,5.12 arc(47.23,3.94) 46.06,3.46 43.73,3.46 arc(42.86,3.1) H4.4
  Bottom Layer w0.2: v2(46.83,28.86) 46.83,27.16 arc(46.96,26.5) 47.34,25.94 arc(47.62,25.51) 47.72,25.02 v2(47.72,12.35) ; v2(52.17,37.75) 52.17,62.08 arc(51.74,64.24) 50.51,66.07 arc(50.05,66.77) 49.88,67.6 49.88,69.01 arc(49.51,69.9) H6.9
ENCODER_DIR_2: length 78.8
  Top Layer w0.2: v2(56.36,37.75) 56.36,35.84 arc(58.22,31.35) v2(62.71,29.49)
  Bottom Layer w0.2: v2(62.71,29.49) 62.71,16.66 arc(64.16,13.16) 67.66,11.71 68.04,11.71 arc(70.29,10.78) 71.22,8.54 71.22,4.98 arc(71.49,3.63) 72.25,2.48 H5.4 ; v2(56.36,37.75) 56.36,45.69 arc(56.16,46.68) 55.59,47.53 arc(54.09,49.78) 53.56,52.43 53.56,64.41 arc(53.4,65.24) 52.93,65.94 arc(52.55,66.5) 52.42,67.17 52.42,69.01 arc(52.05,69.9) H6.7
ENCODER_LSB_1: length 87.9
  Top Layer w0.2: v2(31.97,59.59) v2(31.97,58.32) ; v2(48.48,12.35) v2(48.48,8.79) ; v2(31.97,37.75) v2(31.97,32.92) ; v2(44.42,28.35) 46.83,28.35 arc(47.37,28.12) v2(47.59,27.59)
  Bottom Layer w0.2: v2(48.48,12.35) 48.48,24.96 arc(48.35,25.63) 47.97,26.19 arc(47.69,26.61) 47.59,27.11 v2(47.59,27.59) ; v2(48.48,8.79) 48.48,7.9 arc(47.96,6.64) 46.71,6.12 43.85,6.12 arc(42.9,5.73) H4.3 ; v2(44.42,28.35) 36.54,28.35 arc(33.31,29.69) v2(31.97,32.92) ; v2(31.97,58.32) v2(31.97,37.75) ; v2(31.97,59.59) 31.97,64.42 arc(31.64,65.22) 30.83,65.56 29.31,65.56 arc(27.69,66.23) 27.02,67.84 27.02,69.01 arc(26.65,69.9) H6.27
ENCODER_LSB_2: length 99
  Top Layer w0.2: v2(63.72,29.49) v2(63.72,32.16) ; v2(51.4,46.13) v2(59.66,46.13) ; v2(44.8,46.13) v2(46.71,46.13) ; H6.25 28.3,69.74 arc(28.52,69.21) 29.05,68.99 33.37,68.99 arc(34.18,68.65) 34.51,67.84 34.51,62.65 arc(34.68,61.82) v2(35.15,61.11) ; v2(60.68,35.33) v2(60.68,37.75) ; v2(34.64,58.32) 35.73,59.41 arc(35.86,59.61) v2(35.91,59.84)
  Bottom Layer w0.2: H5.3 72.5,7.89 arc(71.05,11.4) 67.53,12.85 arc(64.84,13.97) 63.72,16.66 v2(63.72,29.49) ; v2(60.68,37.75) 60.68,45.11 arc(60.38,45.83) v2(59.66,46.13) ; v2(35.15,61.11) 35.46,60.8 arc(35.79,60.37) v2(35.91,59.84) ; v2(60.68,35.33) 60.68,35.21 arc(61.57,33.05) v2(63.72,32.16) ; v2(46.71,46.13) v2(51.4,46.13) ; v2(34.64,58.32) arc(34.26,57.76) 34.13,57.09 34.13,56.5 arc(34.26,55.83) 34.64,55.27 43.07,46.85 arc(43.86,46.31) v2(44.8,46.13)
ESC: length 73.2
  Top Layer w0.2: v2(50.39,8.66) v2(50.39,12.35) ; H6.5 arc(54.59,69.9) 54.96,69.01 54.96,67.42 arc(54.43,64.76) v2(52.93,62.51) ; v2(52.93,35.33) arc(53.12,35.61) 53.18,35.95 53.18,37.13 arc(53.12,37.46) v2(52.93,37.75)
  Bottom Layer w0.2: v2(52.93,35.33) 52.93,29.56 arc(52.56,27.74) 51.53,26.19 51.31,25.97 arc(50.63,24.95) 50.39,23.75 v2(50.39,12.35) ; H10.1 H10.2 54.28,4.77 arc(51.53,5.91) v2(50.39,8.66) ; v2(52.93,37.75) arc(52.74,38.03) 52.67,38.36 52.67,61.9 arc(52.74,62.23) v2(52.93,62.51)
GPIO_2: length 58.7
  Top Layer w0.2: R103.1 arc(13.09,30.83) 16.61,33.18 44.74,61.3 arc(46.66,64.19) 47.34,67.59 47.34,69.01 arc(46.97,69.9) H6.11
GPIO_4: length 62.6
  Top Layer w0.2: v2(53.56,49.43) 53.56,54.64 arc(52.63,56.88) v2(50.39,57.81) ; v2(55.47,37.75) 55.47,35.46 arc(57.48,30.61) 62.33,28.6 63.98,28.6 arc(67.73,27.86) 70.91,25.73 v2(73.38,23.27)
  Bottom Layer w0.2: H6.12 46.08,62.12 arc(47.34,59.07) v2(50.39,57.81) ; v2(55.47,37.75) 55.47,45.79 arc(55.34,46.45) 54.96,47.02 54.28,47.7 arc(53.75,48.49) v2(53.56,49.43) ; U9.15 74.25,22.39 arc(73.99,23.01) v2(73.38,23.27)
GPIO_5: length 63.3
  Top Layer w0.2: v2(46.07,40.79) v2(46.07,44.48) ; v2(46.07,29.75) v2(46.07,37.75)
  Bottom Layer w0.2: U37.15 42.75,12.87 arc(43.05,12.14) 43.78,11.84 46.45,11.84 arc(46.81,11.99) v2(46.96,12.35) 46.96,24.89 arc(46.86,25.39) 46.58,25.81 arc(46.2,26.37) 46.07,27.03 v2(46.07,29.75) ; v2(46.07,40.79) v2(46.07,37.75) ; H6.14 43.54,58.48 arc(43.92,57.56) 44.85,57.18 arc(45.71,56.82) 46.07,55.95 v2(46.07,44.48)
I2C_SCL_0: length 54.6
  Top Layer w0.2: H6.18 arc(37.64,63.62) 35.32,60.14 11.45,36.28 arc(9.56,35.01) 7.33,34.57 5.81,34.57 arc(4.91,34.94) 4.54,35.84 4.54,38.15 arc(4.16,39.08) H9.4
I2C_SCL_1: length 80.6
  Top Layer w0.2: H6.15 41.61,70.27 arc(41.98,70.12) 42.13,69.75 42.13,69.5 arc(42.28,69.14) 42.64,68.99 43.55,68.99 arc(44.34,68.66) 44.67,67.87 44.67,67.08 arc(43.97,63.56) 41.98,60.58 16.53,35.13 arc(12.25,32.27) 7.21,31.27 5.56,31.27 arc(2.5,32.53) 1.24,35.59 1.24,45.09 arc(1.82,46.5) H9.10
I2C_SDA_0: length 56.6
  Top Layer w0.2: H9.2 3.23,35.37 arc(3.91,33.73) 5.56,33.05 7.21,33.05 arc(10.14,33.63) 12.63,35.29 38.12,60.79 arc(40.25,63.97) H6.16
I2C_SDA_1: length 73.5
  Top Layer w0.2: H9.8 2.52,43.83 arc(2.14,43.25) 2,42.57 2,35.71 arc(3.04,33.2) 5.56,32.16 7.39,32.16 arc(11.21,32.92) 14.45,35.08 39.03,59.66 arc(41.42,63.24) 42.26,67.46 42.26,67.74 arc(41.89,68.62) 41.01,68.99 39.74,68.99 arc(38.84,69.36) H6.17
LEN: length 71.8
  Top Layer w0.2: v2(45.31,30.38) v2(45.31,37.75) ; v2(45.31,41.3) v2(45.31,44.98) ; v2(38.7,63.53) v2(38.7,62.38)
  Bottom Layer w0.2: v2(45.31,30.38) 45.31,26.73 arc(45.41,26.23) 45.69,25.81 arc(46.06,25.25) 46.2,24.58 v2(46.2,12.35) 43.78,12.35 arc(43.41,12.5) 43.25,12.88 U37.14 ; v2(38.7,62.38) 41.75,62.38 arc(42.47,62.09) 42.77,61.37 42.77,58.32 arc(43.33,56.97) 44.67,56.42 arc(45.12,56.23) 45.31,55.78 45.31,45.11 ; v2(45.31,41.3) v2(45.31,37.75) ; v2(38.7,63.53) 35.91,63.53 arc(35.01,63.9) 34.64,64.8 34.64,69.01 arc(34.27,69.9) H6.21
LH1: length 19.9
  Top Layer w0.3: v2(29.18,13.24) 29.16,13.21 arc(28.89,12.82) 28.8,12.35 28.8,11.58 arc(29.43,10.06) 30.96,9.43 33.73,9.43 arc(35.39,9.76) 36.8,10.69 arc(38.07,11.54) 39.56,11.84 v2(41.24,11.84)
  Bottom Layer w0.3: U37.17 41.75,13.11 arc(41.75,13.11) 41.75,13.11 arc(41.84,13.07) 41.88,12.98 41.88,12.35 arc(41.73,11.99) 41.37,11.84 v2(41.24,11.84) ; v2(29.18,13.24) 29.19,13.25 arc(29.49,13.69) U33.4
LH2: length 20.7
  Bottom Layer w0.3: U37.24 39.67,17.25 arc(38.9,16.93) 38.58,16.16 arc(38.39,15.71) 37.94,15.52 22.89,15.52 arc(21.97,15.14) U35.4
LL1: length 10.6
  Bottom Layer w0.3: U37.19 40.55,13.07 arc(40.12,12.02) 39.06,11.58 37.56,11.58 arc(36.48,11.14) 36.04,10.06 36.04,9.36 arc(35.67,8.46) U34.4
LL2: length 23.1
  Top Layer w0.3: v2(34.77,14.12) 21.75,14.12 arc(20.67,13.68) v2(20.22,12.6)
  Bottom Layer w0.3: U37.22 40.19,16.25 arc(39.77,16.07) 39.59,15.65 arc(39.15,14.57) 38.07,14.12 v2(34.77,14.12) ; U36.4 v2(20.22,12.6)
LSH1: length 13.2
  Top Layer w0.3: v2(41.25,12.6) 33.56,12.6 arc(31.72,11.84) v2(30.96,10)
  Bottom Layer w0.3: U37.18 v2(41.25,12.6)
LSH2: length 17.9
  Bottom Layer w0.3: U37.23 39.93,16.75 arc(39.33,16.5) 39.09,15.9 arc(38.82,15.27) 38.2,15.01 24.92,15.01 arc(24.37,14.78) U35.2
NSLEEP: length 115
  Top Layer w0.3: v2(56.74,17.81) 67.41,17.81 arc(69.92,18.85) 70.96,21.36 70.96,22 arc(71.15,22.45) 71.6,22.63 71.98,22.63 arc(72.34,22.48) v2(72.49,22.12) 77.05,22.12 arc(77.88,22.29) 78.58,22.76 arc(79.29,23.23) 80.12,23.39 v2(85.69,23.39) ; SW7.2 v2(109.82,18.75) ; v2(52.55,14.38) arc(52.14,13.39) 51.15,12.98 45.44,12.98 arc(44.99,13.17) 44.8,13.62 v2(44.8,13.74) arc(44.5,14.46) 43.78,14.76 15.2,14.76 arc(14.03,14.53) 13.05,13.87 12.77,13.59 arc(11.01,12.41) R100.1
  Bottom Layer w0.3: v2(85.69,23.39) 99.28,23.39 arc(101.35,22.54) 102.2,20.47 arc(102.71,19.25) 103.93,18.75 v2(109.82,18.75) ; U9.13 72.93,21.94 arc(72.69,21.99) v2(72.49,22.12) ; v2(56.74,17.81) 55.98,17.81 arc(53.55,16.8) v2(52.55,14.38) ; U37.13 44.49,14.06 arc(44.71,13.97) v2(44.8,13.74)
POWER_BAT: length 1.9
  Bottom Layer w0.7: R84.1 106.68,52 arc(105.85,52.35) v3(105.5,53.18)
  vias: v3(105.5,55.18) v3(105.5,54.18) v3(106.71,55.18) v3(106.69,54.18) v3(106.71,53.18) v3(107.92,55.18) v3(107.92,54.18) v3(107.92,53.18)
POWER_IN: length 27.7
  Bottom Layer w0.7: U8.7 89.44,41.36 arc(89.48,41.35) C70.2 ; C81.2 C84.2 arc(67.85,51.71) 67.87,51.75 U32.7 ; D4.2 77.8,14.18 arc(79.05,14.43) 80.11,15.14 arc(80.95,15.7) 81.95,15.9 84.48,15.9 arc(86.93,16.39) U10.5 ; 38.33,21.33 37.72,21.33 arc(36.6,21.11) 35.66,20.47 33.99,18.81 arc(32.85,18.04) U33.5
  vias: v2(26.3,18.18) v2(26.9,19.22) v2(26.9,17.14) v2(27.5,18.18) v2(28.1,19.22) v2(28.1,17.14) v2(28.7,18.18) v2(67.81,49.32) v2(67.81,48.58) v2(84.16,29.83) v2(84.16,28.74) v2(84.16,27.65) v2(84.16,26.56) v2(84.16,25.47) v2(85.16,29.83) v2(85.16,28.74) v2(85.16,27.65) v2(85.16,26.56) v2(85.16,25.47) v2(87.92,29.83) v2(87.92,28.74) v2(87.92,27.65) v2(87.92,26.56) v2(87.92,25.47) v2(88.92,29.83) v2(88.92,28.74) v2(88.92,27.65) v2(88.92,26.56) v2(88.92,25.47) v2(89.51,40.39) v2(90.25,40.22) v2(90.93,57.78) v2(90.93,56.47) v2(90.93,55.15) v2(91.01,40.39) v2(91.7,18.17) v2(92.05,59.11) v2(92.05,57.79) v2(92.05,56.47) v2(92.05,55.14) v2(92.05,53.83) v2(92.35,19.3) v2(92.35,17.05) v2(93,18.17) v2(93.2,59.11) v2(93.2,57.79) v2(93.2,56.47) v2(93.19,55.14) v2(93.19,53.83) v2(93.65,19.3) v2(93.65,17.05) v2(94.3,18.17) v2(94.41,59.11) v2(94.41,57.79) v2(94.41,56.47) v2(94.39,55.14) v2(94.39,53.83) v2(95.77,55.14) v2(95.77,53.83)
PWM_1: length 72.8
  Top Layer w0.2: v2(32.73,58.32) v2(32.73,59.59) ; v2(54.58,37.75) 54.58,35.33 arc(56.77,30.03) 62.07,27.84 63.72,27.84 arc(67.48,27.09) 70.66,24.97 v2(72.87,22.76)
  Bottom Layer w0.2: v2(72.87,22.76) 73.25,22.76 arc(73.6,22.61) 73.75,22.26 U9.14 ; v2(32.73,59.59) 32.73,65.02 arc(32.64,65.52) 32.35,65.94 arc(32.17,66.22) 32.1,66.55 32.1,69.01 arc(31.73,69.9) H6.23 ; v2(54.58,37.75) arc(54.43,37.39) 54.07,37.24 52.42,37.24 arc(51.83,37.35) 51.34,37.69 34.17,54.85 arc(33.11,56.44) v2(32.73,58.32)
PWM_4: length 22.6
  Bottom Layer w0.2: H1.1 arc(76.55,69.98) 75.57,70.39 63.46,70.39 arc(62.29,70.15) 61.31,69.5 arc(60.75,69.12) 60.08,68.99 57.52,68.99 arc(56.62,69.36) H6.3
RH1: length 16.1
  Top Layer w0.3: v2(78.96,22.12) 86.17,14.92 arc(86.38,14.6) v2(86.46,14.22)
  Bottom Layer w0.3: U9.17 75.25,22.22 arc(75.41,22.6) 75.79,22.76 77.43,22.76 arc(78.26,22.59) v2(78.96,22.12) ; U10.4 v2(86.46,14.22)
RH2: length 39
  Top Layer w0.3: v2(81.38,16.66) 81.37,16.66 arc(79.38,17.06) v2(77.69,18.19)
  Bottom Layer w0.3: U12.4 95.09,14.76 arc(95.32,15.3) 95.85,15.52 99.41,15.52 arc(99.95,15.74) 100.17,16.28 100.17,20.47 arc(99.91,21.1) 99.28,21.36 86.96,21.36 arc(86.16,21.03) 85.82,20.22 85.82,18.19 arc(85.37,17.11) 84.3,16.66 v2(81.38,16.66) ; v2(77.69,18.19) 77.61,18.27 arc(77.08,18.62) U9.24
RL1: length 13.8
  Top Layer w0.3: v2(78.2,20.98) 83.78,15.4 arc(84.56,14.43) v2(84.93,13.24)
  Bottom Layer w0.3: U9.19 77.55,21.25 arc(77.9,21.18) v2(78.2,20.98) ; U11.4 85.31,12.32 arc(85.03,12.74) v2(84.93,13.24)
RL2: length 43.1
  Top Layer w0.3: v2(78.2,19.46) 79.24,18.42 arc(79.64,18.15) v2(80.11,18.06)
  Bottom Layer w0.3: U9.22 77.5,19.75 arc(77.88,19.67) v2(78.2,19.46) ; v2(80.11,18.06) 83.79,18.06 arc(84.33,18.28) 84.55,18.82 84.55,20.35 arc(85.22,21.96) 86.84,22.63 99.16,22.63 arc(100.77,21.96) 101.44,20.35 101.44,9.26 arc(101.1,8.44) U13.4
RSH1: length 19.5
  Top Layer w0.3: v2(78.46,21.62) 84.8,15.28 arc(85.46,14.28) 85.69,13.11 arc(86.6,10.91) 88.8,10 v3(89.28,10)
  Bottom Layer w0.3: U9.18 77.67,21.94 arc(78.1,21.86) v2(78.46,21.62)
RSH2: length 36.6
  Top Layer w0.3: v2(77.95,18.82) 78.66,18.11 arc(79.56,17.51) v2(80.61,17.3)
  Bottom Layer w0.3: U9.23 76.92,19.25 arc(77.47,19.14) v2(77.95,18.82) ; v2(80.61,17.3) 83.92,17.3 arc(84.81,17.67) 85.19,18.57 85.19,20.35 arc(85.67,21.51) 86.84,22 99.28,22 arc(100.36,21.55) 100.81,20.47 100.81,16.13 arc(100.25,14.78) U12.1
SERVO_POWER: length 40.2
  Top Layer w1.5: v3(62.97,54.88) v3(62.97,55.77) 62.97,60.96 arc(64.29,64.16) 67.49,65.48 75.98,65.48 arc(78.47,66.51) H1.2
  Bottom Layer w0.7: v3(62.96,56.66) 62.28,56.66 arc(61.15,57.13) 60.68,58.27 60.68,60.35 arc(61.25,61.73) 62.63,62.31 67.29,62.31
SPI_CLK_1: length 43.5
  Top Layer w0.2: H6.22 arc(32.03,60.92) 28.17,55.15 12.89,39.87 arc(9.62,37.69) H9.1
SPI_CS_1: length 40
  Top Layer w0.2: H9.3 arc(9.86,40.27) 13.32,42.59 25.45,54.72 arc(29.44,60.69) H6.24
SPI_MISO_1: length 36.6
  Top Layer w0.2: H9.5 arc(10.32,42.91) 14.19,45.49 22.55,53.85 arc(26.81,60.22) H6.26
SPI_MOSI_1: length 33.5
  Top Layer w0.2: H6.28 25.76,65.21 arc(24.64,59.56) 21.43,54.76 15.05,48.39 arc(10.79,45.54) H9.7
$1N774: length 6.9
  Bottom Layer w0.3: C109.1 101.24,34.5 arc(102.1,34.86) 102.46,35.71 102.46,37.64 arc(102.28,38.07) 101.85,38.25 U20.6
$1N1611: length 19.3
  Bottom Layer w0.3: USB1.13 USB1.13 USB1.14 110.5,42.33 ; 110.5,42.33 USB1.14 ; 110.5,42.33 C65.2
$1N1615: length 3.5
  Top Layer w0.2: R77.1 104.72,35.43 arc(105.42,35.57) 106.01,35.97 106.25,36.2 arc(106.86,36.61) USB1.4
$1N1616: length 3.3
  Top Layer w0.2: R78.1 105.16,40.57 arc(105.69,40.46) 106.14,40.16 arc(106.59,39.86) 107.13,39.75 USB1.10
$1N2181: length 2.5
  Top Layer w0.3: LED9.1 R100.2
$1N2274: length 2.5
  Top Layer w0.3: LED5.1 R101.2
$1N2277: length 2.5
  Top Layer w0.3: LED6.1 R102.2
$1N5007: length 2.5
  Top Layer w0.3: LED7.1 R104.2
$1N5091: length 2.5
  Top Layer w0.3: LED8.1 R103.2
$1N6060: length 3
  Top Layer w0.7: BUZZER2.2 v2(6.95,60.3)
  Bottom Layer w0.7: v2(6.95,60.3) 7.97,60.3 arc(8.59,60.18) Q1.3
$1N6061: length 1.8
  Top Layer w0.7: BUZZER2.1 v2(6.95,55.7)
  Bottom Layer w0.7: v2(6.95,55.7) R96.2
$1N6379: length 2.1
  Bottom Layer w0.7: Q1.1 10.06,55.89 arc(10.08,55.79) R97.2
$2N420: length 15
  Top Layer w0.7: v3(86.18,39.27) 86.18,43.86 arc(85.41,45.73) v3(83.53,46.51)
  Bottom Layer w0.7: L5.1 89.4,36.87 arc(88.46,39.15) U8.8 v3(86.18,39.27)
$2N423: length 5.2
  Top Layer w0.4: v3(77.99,42) 78.09,42 arc(80.02,42.8) v3(80.82,44.73)
  Bottom Layer w0.4: U8.4 v3(80.82,44.73)
$2N424: length 9
  Bottom Layer w0.7: C78.2 80.48,46.5 arc(79.59,46.13) 79.22,45.24 79.22,41.3 arc(79.57,40.45) 80.42,40.09 U8.1
$2N1388: length 13.3
  Top Layer w0.7: v3(109.19,52) arc(109.91,52.3) 110.21,53.02 110.21,55.01 arc(110.42,55.53) SW1.1 106.73,59.96 arc(106.46,60.37) v3(106.36,60.86)
  Bottom Layer w0.7: 106.36,61.5 v3(106.36,60.86) ; R84.2 v3(109.19,52)
$2N1393: length 3.4
  Top Layer w0.7: v3(109.62,58.75) SW1.2
  Bottom Layer w0.7: Q2.1 v3(109.62,58.75)
$2N1402: length 5
  Top Layer w0.7: v3(108.28,62.15) 109.66,60.78 arc(110.25,60.39) SW1.3
  Bottom Layer w0.7: R85.2 108.25,62.43 arc(108.35,61.93) 108.64,61.5
$2N1983:
  vias: v3(64.6,52) v3(64.6,50.81) v3(72.99,57.81) v3(73.92,57.8)
$2N1987: length 8.6
  Bottom Layer w0.7: U32.1 66.59,60.18 arc(66.91,60.93) 67.66,61.24 72.41,61.24 arc(73.16,60.93) C82.2
$2N2225: length 6.9
  Bottom Layer w0.4: 68.79,62.31 68.79,68.71 arc(68.71,68.91) R99.2
$2N2229: length 12.4
  Top Layer w0.4: v3(70.34,63.26) 70.34,60.82 arc(70.67,60.01) v3(71.47,59.68)
  Bottom Layer w0.4: U32.4 v3(71.47,59.68) ; R88.2 v3(70.34,63.26) 70.34,68.34 arc(70.53,68.81) R99.3
$3N995: length 5.4
  Bottom Layer w0.3: U9.8 72.02,19.25 arc(71.54,19.05) 71.34,18.57 71.34,15.47 arc(71.48,15.14) C100.2
$3N996: length 9.1
  Top Layer w0.3: v2(71.75,22.05) 71.75,18.29 arc(71.82,18.13) v2(71.98,18.06)
  Bottom Layer w0.3: U9.12 v2(71.75,22.05) 70.77,23.04 arc(70.68,23.09) C99.2 ; v2(71.98,18.06) U9.6 arc(73.24,18.06) 73.24,18.06 U9.7
$3N998: length 3.2
  Bottom Layer w0.3: U9.3 74.75,16.58 arc(74.92,15.72) C98.2
$3N1000: length 8.8
  Bottom Layer w0.3: U9.1 77,16.81 arc(77.44,16.52) C95.1 78.03,16.41 arc(78.78,16.27) D4.1 arc(79.07,16.35) 78.96,16.94 C94.1 C93.1
$3N1001: length 3.2
  Bottom Layer w0.3: U9.2 75.25,17.68 arc(75.29,17.47) 75.41,17.3 76.98,15.73 arc(77.07,15.67) C95.2
$3N1943: length 6.4
  Bottom Layer w0.3: C101.2 44.91,21 arc(45.37,20.81) 45.56,20.35 45.56,17.3 arc(45.4,16.91) 45.01,16.75 U37.8
$3N1944: length 8.7
  Top Layer w0.2: v2(45.56,16.16) 45.56,17.31 arc(45.38,17.76) v2(44.93,17.94)
  Bottom Layer w0.2: v2(45.56,16.16) 45.56,15.38 arc(45.38,14.94) 44.93,14.75 U37.12
  Bottom Layer w0.3: U37.6 v2(44.93,17.94) ; U37.6 43.75,19.29 arc(43.83,19.67) C102.2 ; U37.6 44.44,17.25 arc(44.44,17.25) U37.7
$3N1946: length 3.7
  Bottom Layer w0.3: C97.2 arc(40.5,20.77) 40.63,20.58 41.53,19.68 arc(42.06,18.88) U37.3
$3N1948: length 8.5
  Bottom Layer w0.3: 36.67,19.67 36.77,19.67 arc(37.5,19.53) C96.1 ; C91.1 37.6,17.87 arc(37.73,18.54) C96.1 ; C96.1 arc(38.16,19) 38.28,18.95 40.24,18.95 arc(40.95,18.65) U37.1
  Bottom Layer w0.7: C91.1 C92.1
$3N1949: length 4
  Bottom Layer w0.3: C96.2 39.81,19.89 arc(41.18,19.32) U37.2
$3N2353: length 3.4
  Bottom Layer w0.3: C97.1 41.54,20.95 arc(41.66,20.35) 42.01,19.84 arc(42.56,19.01) 42.75,18.04 U37.4
$3N2389: length 3.1
  Bottom Layer w0.3: U9.4 74.25,15.15 arc(74.27,15.07) C98.1

## Copper pours and planes (outline as drawn; the poured copper is in the pictures)
+5V on Bottom Layer: 77.56,40.15 80.42,40.15 80.42,35.29 77.56,35.29
DGND on Top Layer: -7.75,84.72 120.43,84.72 120.43,-5.37 -7.75,-5.37
DGND on Bottom Layer: -7.81,84.88 120.37,84.88 120.37,-5.21 -7.81,-5.21
PGND on Top Layer: 33.88,21.74 35.53,21.74 35.53,17.3 33.88,17.3
PGND on Top Layer: 65.5,32.41 81.63,32.41 81.63,29.24 65.5,29.24
PGND on Bottom Layer: 89.05,43.1 91.45,43.1 91.45,42.3 89.05,42.3
PGND on Bottom Layer: 85.28,10.88 86.17,10.88 86.17,7.85 85.28,7.85
PGND on Bottom Layer: 99.83,12.15 100.72,12.15 100.72,9.12 99.83,9.12
PGND on Bottom Layer: 63.62,71.58 63.62,67.24 62.76,65.15 58.88,63.55 58.13,61.75 58.13,31.4 56.01,26.28 50.9,24.16 22.83,24.16 19.78,22.89 18.51,19.84 18.51,0 18.51,0 103.36,0 103.36,19.7 101.91,23.21 98.39,24.67 95.98,24.67 92.75,26 91.41,29.24 91.41,44.48 92.64,47.44 95.6,48.67 115,48.67 115,48.67 115,72.5 113.98,74.98 111.5,76 111.5,76 109.03,74.97 108,72.5 63.62,72.5 63.62,71.58
PGND on Bottom Layer: 19.78,10.88 20.67,10.88 20.67,7.85 19.78,7.85
PGND on Bottom Layer: 34.33,12.15 35.22,12.15 35.22,9.12 34.33,9.12
LSH1 on Bottom Layer: 28,14.67 33.65,14.67 33.65,1.5 28,1.5
LSH2 on Bottom Layer: 23,5.5 27,5.5 27,1.5 23,1.5
LSH2 on Bottom Layer: 21.9,14.67 27,14.67 27,3.5 21.9,3.5
POWER_BAT on Top Layer: 96.04,70.67 109.01,70.67 109.01,52.73 96.04,52.73
POWER_BAT on Bottom Layer: 105.07,55.62 109,55.62 109,52.73 105.07,52.73
POWER_IN on Top Layer: 115,72.5 113.97,74.97 111.5,76 109.03,74.97 108,72.5 63.61,72.5 63.61,67.23 62.75,65.15 60.68,64.29 56.92,63.54 53.74,61.42 22.97,30.65 19.66,25.69 18.49,19.84 18.49,0.01 18.5,0 103.37,0 103.37,19.69 101.91,23.21 98.39,24.67 95.98,24.67 92.75,26 91.41,29.24 91.41,44.46 92.64,47.43 95.6,48.66 114.99,48.66 115,48.65
POWER_IN on Bottom Layer: 89.05,41.69 91.45,41.69 91.45,40.9 89.05,40.9
POWER_IN on Bottom Layer: 67.4,50.64 68.19,50.64 68.19,48.23 67.4,48.23
POWER_IN on Bottom Layer: 86.8,20.45 99.2,20.45 99.2,15.9 86.8,15.9
POWER_IN on Bottom Layer: 21.3,20.45 33.7,20.45 33.7,15.9 21.3,15.9
POWER_IN on Bottom Layer: 90.52,59.46 104.06,59.46 104.06,53.47 90.52,53.47
POWER_IN on Bottom Layer: 83.8,30.26 89.35,30.26 89.35,25.05 83.8,25.05
POWER_IN on Bottom Layer: 89.05,41.69 91.45,41.69 91.45,39.86 89.05,39.86
RSH1 on Bottom Layer: 83,14.67 91.95,14.67 91.95,1.49 83,1.49
RSH2 on Bottom Layer: 88,14.67 99.15,14.67 99.15,1.5 88,1.5
SERVO_POWER on Bottom Layer: 61.78,57.41 64.15,57.41 64.15,54.18 61.78,54.18
$2N420 on Bottom Layer: 82.3,47.29 85.9,47.29 85.9,45.71 82.3,45.71
$2N423 on Bottom Layer: 77.56,43.15 78.42,43.15 78.42,40.85 77.56,40.85
$2N1983 on Top Layer: 64.19,58.14 74.26,58.14 74.26,50.38 64.19,50.38
$2N1983 on Bottom Layer: 72.67,59.19 74.25,59.19 74.25,55.38 72.67,55.38
$2N1983 on Bottom Layer: 62.02,55.25 66.91,55.25 66.91,50.12 62.02,50.12

Small or netless copper shapes (teardrops, artwork), in the pictures only: 210 on Top Layer, 286 on Bottom Layer

## Text on the board
Top Silkscreen Layer: USR | PWR | RXD | TXD | MTR | 9 | 1 | 30 | G | ON | 20TH-SMARTCAR | INTERFACES | LOONGSON | 99PI
